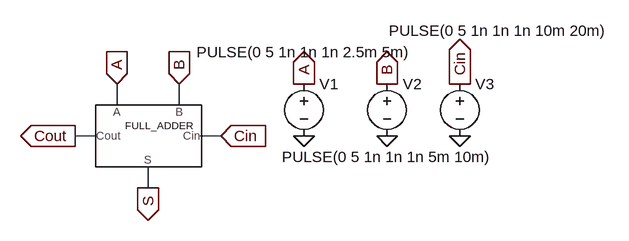
[diagram p0: schematic Simulated_Full_Adder.asc]
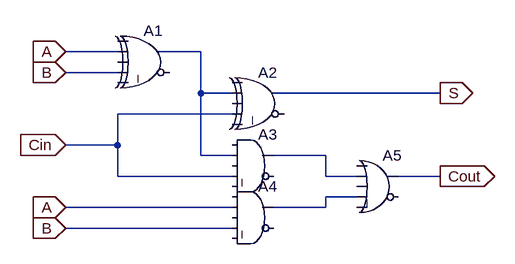
[diagram p1: sub-circuit full_adder.asc]
Simulated_Full_Adder.asc, the LTspice schematic file:
Version 4
SHEET 1 1040 680
WIRE 128 128 128 96
WIRE 224 128 224 96
WIRE 96 176 64 176
WIRE 288 176 256 176
WIRE 176 256 176 224
FLAG 128 96 A
IOPIN 128 96 In
FLAG 224 96 B
IOPIN 224 96 In
FLAG 288 176 Cin
IOPIN 288 176 In
FLAG 176 256 S
IOPIN 176 256 Out
FLAG 64 176 Cout
IOPIN 64 176 Out
FLAG 416 96 A
IOPIN 416 96 Out
FLAG 544 96 B
IOPIN 544 96 Out
FLAG 656 96 Cin
IOPIN 656 96 Out
FLAG 416 176 0
FLAG 544 176 0
FLAG 656 176 0
SYMBOL Full_Adder 176 176 R0
SYMATTR InstName FULL_ADDER
SYMBOL voltage 416 80 R0
WINDOW 3 -165 -33 Left 2
WINDOW 123 0 0 Left 0
WINDOW 39 0 0 Left 0
SYMATTR InstName V1
SYMATTR Value PULSE(0 5 1n 1n 1n 2.5m 5m)
SYMBOL voltage 544 80 R0
WINDOW 3 -162 128 Left 2
WINDOW 123 0 0 Left 0
WINDOW 39 0 0 Left 0
SYMATTR InstName V2
SYMATTR Value PULSE(0 5 1n 1n 1n 5m 10m)
SYMBOL voltage 656 80 R0
WINDOW 3 -109 -66 Left 2
WINDOW 123 0 0 Left 0
WINDOW 39 0 0 Left 0
SYMATTR InstName V3
SYMATTR Value PULSE(0 5 1n 1n 1n 10m 20m)

full_adder.asc, the sub-circuit schematic file:
Version 4
SHEET 1 880 680
WIRE 64 48 -16 48
WIRE 192 48 128 48
WIRE 64 80 -16 80
WIRE 192 112 192 48
WIRE 240 112 192 112
WIRE 560 112 304 112
WIRE 240 144 64 144
WIRE 64 192 64 144
WIRE 64 192 -16 192
WIRE 192 208 192 112
WIRE 240 208 192 208
WIRE 384 208 304 208
WIRE 64 240 64 192
WIRE 240 240 64 240
WIRE 384 240 384 208
WIRE 432 240 384 240
WIRE 560 240 496 240
WIRE 432 272 384 272
WIRE 240 288 -16 288
WIRE 384 288 384 272
WIRE 384 288 304 288
WIRE 240 320 -16 320
FLAG -16 48 A
IOPIN -16 48 In
FLAG -16 80 B
IOPIN -16 80 In
FLAG -16 192 Cin
IOPIN -16 192 In
FLAG -16 288 A
IOPIN -16 288 In
FLAG -16 320 B
IOPIN -16 320 In
FLAG 560 112 S
IOPIN 560 112 Out
FLAG 560 240 Cout
IOPIN 560 240 Out
SYMBOL Digital\\xor 112 0 R0
SYMATTR InstName A1
SYMBOL Digital\\xor 288 64 R0
SYMATTR InstName A2
SYMBOL Digital\\and 272 160 R0
SYMATTR InstName A3
SYMBOL Digital\\and 272 240 R0
SYMATTR InstName A4
SYMBOL Digital\\or 464 192 R0
SYMATTR InstName A5

The netlist it stands for:
* Simulated_Full_Adder.asc
XFULL_ADDER A B Cout Cin S full_adder
V1 A 0 PULSE(0 5 1n 1n 1n 2.5m 5m)
V2 B 0 PULSE(0 5 1n 1n 1n 5m 10m)
V3 Cin 0 PULSE(0 5 1n 1n 1n 10m 20m)

* block symbol definitions
.subckt full_adder A B Cout Cin S
A1 0 A 0 B 0 0 N001 0 XOR
A2 0 N001 0 Cin 0 0 S 0 XOR
A3 0 N001 0 Cin 0 0 N002 0 AND
A4 0 A 0 B 0 0 N003 0 AND
A5 0 N002 0 N003 0 0 Cout 0 OR
.ends full_adder

.backanno
.end